# EAGLE design BARRERA (EAGLE 6.3)
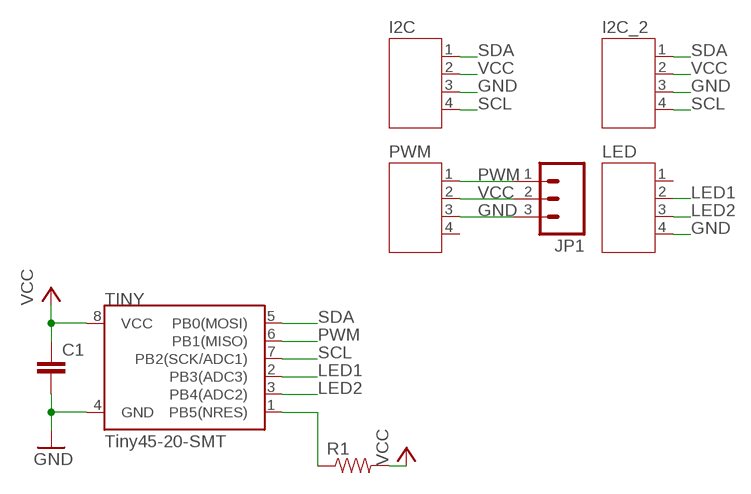
[diagram p0: schematic, sheet 1]

## Parts
C1  CAP0603-CAP  [0603-CAP]
I2C  JST-PH4  [JST-PH4]
I2C_2  JST-PH4  [JST-PH4]
JP1  M03PTH  [1X03]
LED  JST-PH4  [JST-PH4]
PWM  JST-PH4  [JST-PH4]
R1  RESISTOR0603  [0603-RES]
TINY  Tiny45-20-SMT  ATTINY45TINY45-20-SMT  [SO08-EIAJ]

## Nets
GND: C1.2 I2C.3 I2C_2.3 JP1.3 LED.4 PWM.3 TINY.4(GND)
LED1: LED.2 TINY.2(PB3(ADC3))
LED2: LED.3 TINY.3(PB4(ADC2))
N$3: R1.1 TINY.1(PB5(NRES))
PWM: JP1.1 PWM.1 TINY.6(PB1(MISO))
SCL: I2C.4 I2C_2.4 TINY.7(PB2(SCK/ADC1))
SDA: I2C.1 I2C_2.1 TINY.5(PB0(MOSI))
VCC: C1.1 I2C.2 I2C_2.2 JP1.2 PWM.2 R1.2 TINY.8(VCC)
Unconnected: LED.1 PWM.4

## Library data of the parts
C1 = SparkFun-Capacitors:CAP: Capacitor Standard 0603 ceramic capacitor, and 0.1" leaded capacitor.
I2C I2C_2 LED PWM = jst-ph:JST-PH4
JP1 = SparkFun:M03: Header 3 Standard 3-pin 0.1" header. Use with straight break away headers (SKU : PRT-00116), right angle break away headers (PRT-00553), swiss pins (PRT-00743), machine pins (PRT-00117), and female headers (PRT-00115). Molex polarized connector foot print use with SKU : PRT-08232 with associated crimp pins and housings.
R1 = SparkFun-Resistors:RESISTOR: Resistor Basic schematic elements and footprints for 0603, 1206, and PTH resistors.
TINY = SparkFun-DigitalIC:ATTINY45: Atmel 8-pin 2/4/8kB flash uC; PROD_ID: IC-08922

## Board
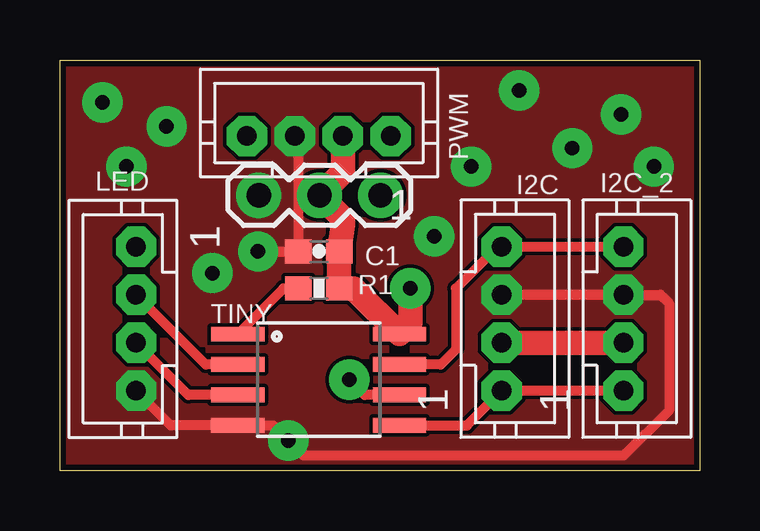
[diagram p1: board, top side]
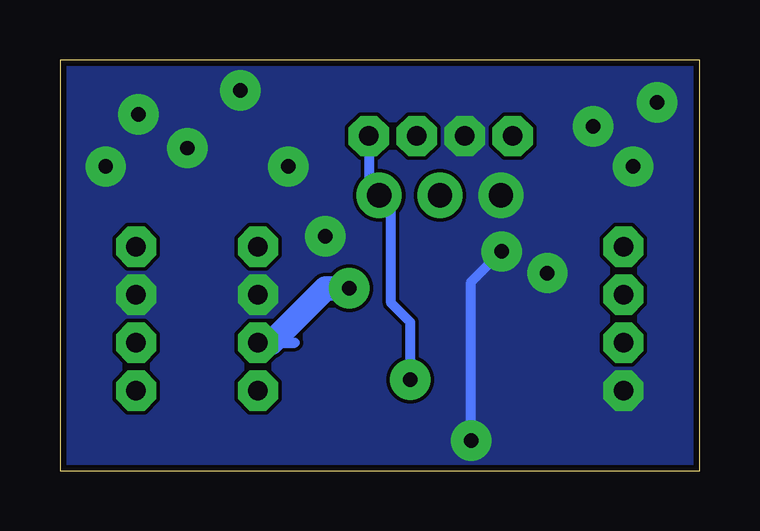
[diagram p2: board, bottom side, seen from below]

Size 26.67 x 17.14 mm. Coordinates in mm from the lower left corner, seen from the top.
Outline: 0,0 0,17.14 26.67,17.14 26.67,0 0,0
Copper layers (1*16): Top 0.035mm / dielectric 1.5mm / Bottom 0.035mm
Design rules "ITEADstudio_DRC": minimum track width 6mil, minimum drill 12mil, track to track 6mil, track to pad 6mil, pad to pad 6mil, via to via 6mil, smd to smd 0mil, copper to edge 10mil, drill to drill 10mil, minimum pad ring 10mil, minimum via ring 6mil, stop-mask expansion 2mil, vias tented up to drill 100mil, thermal gap 10mil

### Footprints (pad centres in the part's own frame; a part is rotated, then mirrored left to right if it is on the bottom)
0603-CAP = smd 1.1 x 1: 1 -0.85,0; 2 0.85,0
JST-PH4 = drill 0.813 pad 1.676 octagon: 1 3,0; 2 1,0; 3 -1,0; 4 -3,0
1X03 = drill 1.016 pad 1.88: 1 0,0; 2 2.54,0; 3 5.08,0
0603-RES = smd 1.1 x 1: 1 -0.85,0; 2 0.85,0
SO08-EIAJ = smd 0.61 x 2.21: 1 -1.905,-3.378; 2 -0.635,-3.378; 3 0.635,-3.378; 4 1.905,-3.378; 5 1.905,3.353; 6 0.635,3.353; 7 -0.635,3.353; 8 -1.905,3.353

### Placement (x,y rotation side)
C1  10.79,9.16 180 top
I2C  18.41,6.35 270 top
I2C_2  23.49,6.35 270 top
JP1  13.37,11.5 180 top
LED  3.17,6.35 90 top
PWM  10.79,13.97 0 top
R1  10.79,7.62 0 top
TINY  10.79,3.81 270 top

### Tracks (layer width: path | path; a pad name or v marks a point on that pad's centre or on a via)
GND  (via drill 0.6 pad 1.68)
  Top 0.406: LED.4 4.62,1.91 TINY.4 8.89,1.91 v9.53,1.27 10.16,0.64 23.49,0.64 25.4,2.54 25.4,6.99 25.04,7.35 I2C_2.3 I2C.3 | PWM.3 9.95,13.82 C1.2 v8.26,9.16
  Bottom 0.406: v9.53,1.27 9.53,7.89 v8.26,9.16
  other vias: 23.4,14.88 19.14,15.88 15.6,9.79 6.35,8.26 24.76,12.7 17.14,12.7 21.36,13.47 4.45,14.38 1.77,15.38 2.77,12.7
  pour Top (no thermals): -1.27,17.78 -1.27,-0.64 28.57,-0.64 28.57,18.41 -0.64,18.41
  pour Bottom (no thermals): -1.27,18.41 28.57,18.41 28.57,-0.64 -0.64,-0.64 -1.27,0
LED1
  Top 0.406: TINY.2 6.08,4.45 LED.2
LED2
  Top 0.406: TINY.3 5.35,3.17 LED.3
N$3
  Top 0.406: TINY.1 9.32,7.62 R1.1
PWM  (via drill 0.6 pad 1.68)
  Top 0.406: TINY.6 12.7,3.17 v12.06,3.81
  Bottom 0.406: v12.06,3.81 12.06,6.2 12.87,7 12.87,11 JP1.1 13.79,11.93 PWM.1
SCL
  Top 0.406: I2C_2.4 I2C.4 18.24,9.35 16.51,7.62 16.51,5.08 15.88,4.45 TINY.7
SDA
  Top 0.406: I2C_2.1 I2C.1 16.97,1.91 TINY.5
VCC  (via drill 0.6 pad 1.68)
  Top 0.406: 13.55,5.71 TINY.8 14.61,6.17
  Top 1.016: TINY.8 12.24,7.62 R1.2 C1.1 11.79,10.31 11.79,10.53 JP1.2 11.79,12.47 PWM.2 | 14.61,6.17 v14.61,7.62 | I2C_2.2 I2C.2
  Bottom 0.406: I2C.2 17.86,5.35 16.88,5.35
  Bottom 1.016: v14.61,7.62 15.6,7.62 17.86,5.35